# EAGLE design clvHd (EAGLE 9.6.2)
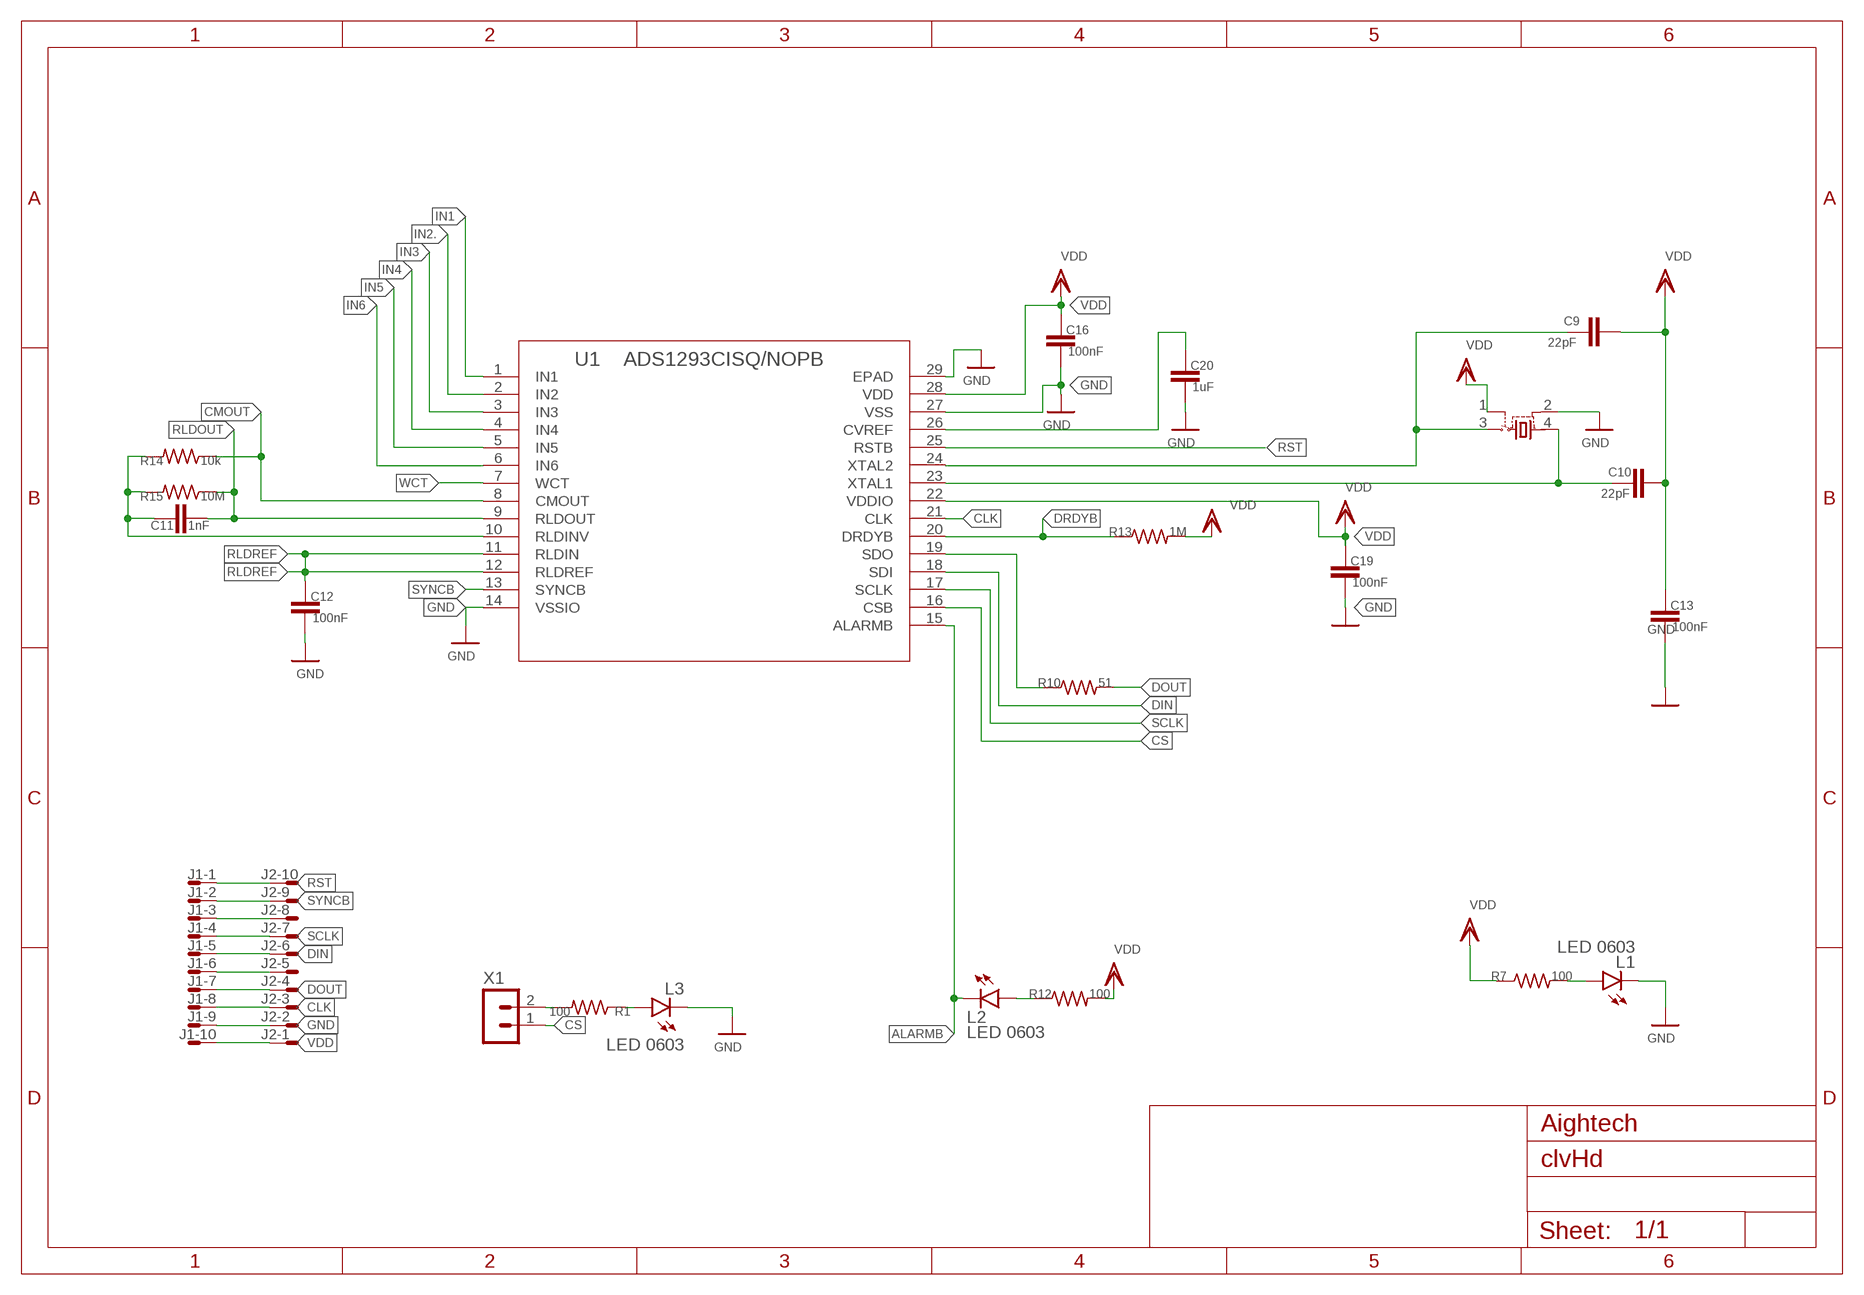
[diagram p0: schematic, sheet 1]

## Parts
C9  22pF  C-EUC0402  [C0402]
C10  22pF  C-EUC0402  [C0402]
C11  1nF  C-EUC0402  [C0402]
C12  100nF  C-EUC0402  [C0402]
C13  100nF  C-EUC0402  [C0402]
C16  100nF  C-EUC0402  [C0402]
C19  100nF  C-EUC0402  [C0402]
C20  1uF  C-EUC0402  [C0402]
J1  XF2J-1024-12  [XF2J-1024-12]
J2  XF2J-1024-12  [XF2J-1024-12]
L1  LED 0603  LEDCHIP-LED0603  [CHIP-LED0603]
L2  LED 0603  LEDCHIP-LED0603  [CHIP-LED0603]
L3  LED 0603  LEDCHIP-LED0603  [CHIP-LED0603]
R1  100  R-US_R0402  [R0402]
R7  100  R-US_R0402  [R0402]
R10  51  R-US_R0402  [R0402]
R12  100  R-US_R0402  [R0402]
R13  1M  R-US_R0402  [R0402]
R14  10k  R-US_R0402  [R0402]
R15  10M  R-US_R0402  [R0402]
U1  ADS1293CISQ/NOPB  [RSG28_3P6X3P6_TEX]
U$1  C387328  C387328  [SMD-3225_4P]
X1  BM02B-SRSS-TB  [BM02B-SRSS-TB]

## Nets
ALARMB: L2.C U1.15(ALARMB)
CLK: J1.8 J2.3 U1.21(CLK)
CMOUT: R14.1 U1.8(CMOUT)
CS: U1.16(CSB) X1.1
DIN: J1.5 J2.6 U1.18(SDI)
DOUT: J1.7 J2.4 R10.2
DRDYB: R13.1 U1.20(DRDYB)
GND: C12.2 C13.2 C16.2 C19.2 C20.2 J1.3 J1.6 J1.9 J2.2 J2.5 J2.8 L1.C L3.C U1.14(VSSIO) U1.27(VSS) U1.29(EPAD) U$1.2(GND)
IN1: U1.1(IN1)
IN2.: U1.2(IN2)
IN3: U1.3(IN3)
IN4: U1.4(IN4)
IN5: U1.5(IN5)
IN6: U1.6(IN6)
N$2: L1.A R7.2
N$3: R10.1 U1.19(SDO)
N$4: C10.2 U1.23(XTAL1) U$1.4(VDD)
N$5: R1.2 X1.2
N$6: L2.A R12.1
N$7: L3.A R1.1
N$8: C9.2 U1.24(XTAL2) U$1.3(OUT)
N$9: C20.1 U1.26(CVREF)
N$15: C11.1 R14.2 R15.2 U1.10(RLDINV)
RLDOUT: C11.2 R15.1 U1.9(RLDOUT)
RLDREF: C12.1 U1.11(RLDIN) U1.12(RLDREF)
RST: J1.1 J2.10 U1.25(RSTB)
SCLK: J1.4 J2.7 U1.17(SCLK)
SYNCB: J1.2 J2.9 U1.13(SYNCB)
VDD: C9.1 C10.1 C13.1 C16.1 C19.1 J1.10 J2.1 R7.1 R12.2 R13.2 U1.22(VDDIO) U1.28(VDD) U$1.1(TRI)
WCT: U1.7(WCT)

## Notes on the sheet
- Aightech

## Library data of the parts
C9-C13 C16 C19 C20 = rcl:C-EU: CAPACITOR, European symbol; SPICEPREFIX: C
J1 J2 = con-omron:XF2*-10?: OMRON FPC Connector Source : http://www.omron.com/ecb/products/pdf/fpc.pdf; OC_FARNELL: unknown; OC_NEWARK: unknown
L1-L3 = led:LED: LED OSRAM: - CHIPLED LG R971, LG N971, LY N971, LG Q971, LY Q971, LO R971, LY R971 LH N974, LH R974 LS Q976, LO Q976, LY Q976 LO Q996 - Hyper CHIPLED LW Q18S LB Q993, LB Q99A, LB R99A - SideLED LS A670, LO A670, LY A670, LG A670, LP A670 LB A673, LV A673, LT A673, LW A673 LH A674 LY A675 LS A676, LA A676, LO A676, LY A676, LW A676 LS A679, LY A679, LG A679 - Hyper Micro SIDELED® LS Y876, LA Y876, LO Y876, LY Y876 LT Y87S - SmartLED LW L88C, LW L88S LB L89C, LB L89S, LG L890 LS L89K, LO L89K, LY L89K LS L896, LA L896, LO L896, LY L896 - TOPLED LS T670, LO T670, LY T670, LG T670, LP T670 LSG T670, LSP T670, LSY T670, LOP T670, LYG T670 LG T671, LOG T671, LSG T671 LB T673, LV T673, LT T673, LW T673 LH T674 LS T676, LA T676, LO T676, LY T676, LB T676, LH T676, LSB T676, LW T676 LB T67C, LV T67C, LT T67C, LS T67K, LO T67K, LY T67K, LW E67C LS E67B, LA E67B, LO E67B, LY E67B, LB E67C, LV E67C, LT E67C LW T67C LS T679, LY T679, LG T679 LS T770, LO T770, LY T770, LG T770, LP T770 LB T773, LV T773, LT T773, LW T773 LH T774 LS E675, LA E675, LY E675, LS T675 LS T776, LA T776, LO T776, LY T776, LB T776 LHGB T686 LT T68C, LB T68C - Hyper Mini TOPLED® LB M676 - Mini TOPLED Santana® LG M470 LS M47K, LO M47K, LY M47K Source: http://www.osram.convergy.de LUXEON: - LUMILED® LXK2-PW12-R00, LXK2-PW12-S00, LXK2-PW14-U00, LXK2-PW14-V00 LXK2-PM12-R00, LXK2-PM12-S00, LXK2-PM14-U00 LXK2-PE12-Q00, LXK2-PE12-R00, LXK2-PE12-S00, LXK2-PE14-T00, LXK2-PE14-U00 LXK2-PB12-K00, LXK2-PB12-L00, LXK2-PB12-M00, LXK2-PB14-N00, LXK2-PB14-P00, LXK2-PB14-Q00 LXK2-PR12-L00, LXK2-PR12-M00, LXK2-PR14-Q00, LXK2-PR14-R00 LXK2-PD12-Q00, LXK2-PD12-R00, LXK2-PD12-S00 LXK2-PH12-R00, LXK2-PH12-S00 LXK2-PL12-P00, LXK2-PL12-Q00, LXK2-PL12-R00 Source: www.luxeon.com KINGBRIGHT: KA-3528ASYC Source: www.kingbright.com
R1 R7 R10 R12 R14 R15 = rcl:R-US_: RESISTOR, American symbol; SPICEPREFIX: R
R13 = rclCustom:R-US_: RESISTOR, American symbol; SPICEPREFIX: R
U1 = ADS:ADS1293CISQ/NOPB; BUILT_BY: EMA_UL_Team; MANUFACTURER_PART_NUMBER: ADS1293CISQ/NOPB; SOURCELIBRARY: TI_2016-05-20; VENDOR: Texas Instruments
U$1 = crystalCustom:C387328: 3.3Vdc CMOS SMD CRYSTAL CLOCK OSCILLATOR SOurce: www.abracon.com; OC_FARNELL: unknown; OC_NEWARK: unknown
X1 = con-JST SH:BM02B-SRSS: JST SH series header 1.00mm pitch disconnectable crimp style connectors, vertical (side entry type), 2 pins

## Board
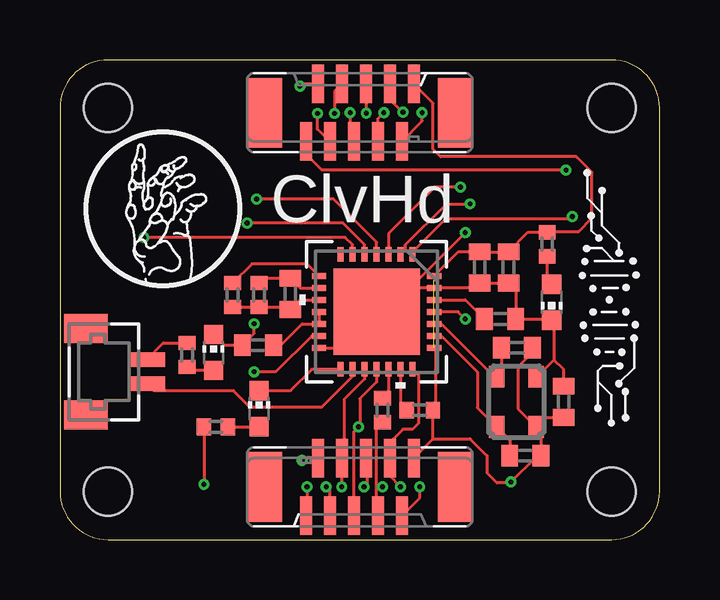
[diagram p1: board, top side]
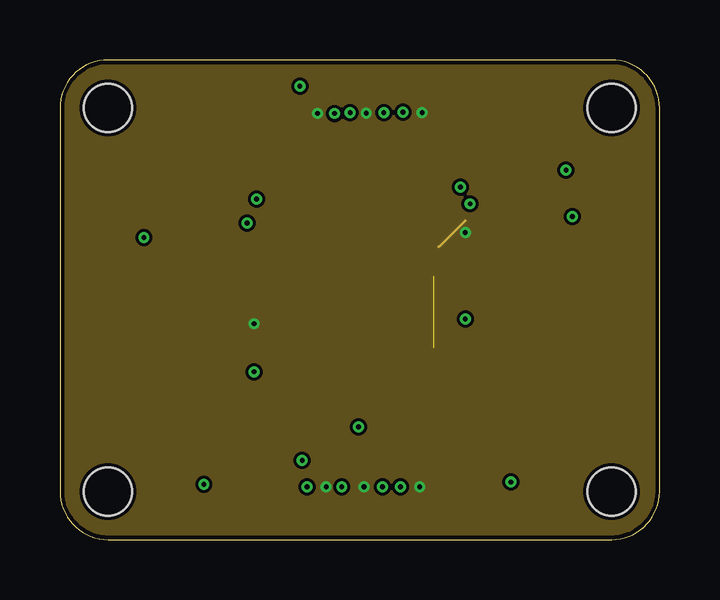
[diagram p2: board, inner layer Route2]
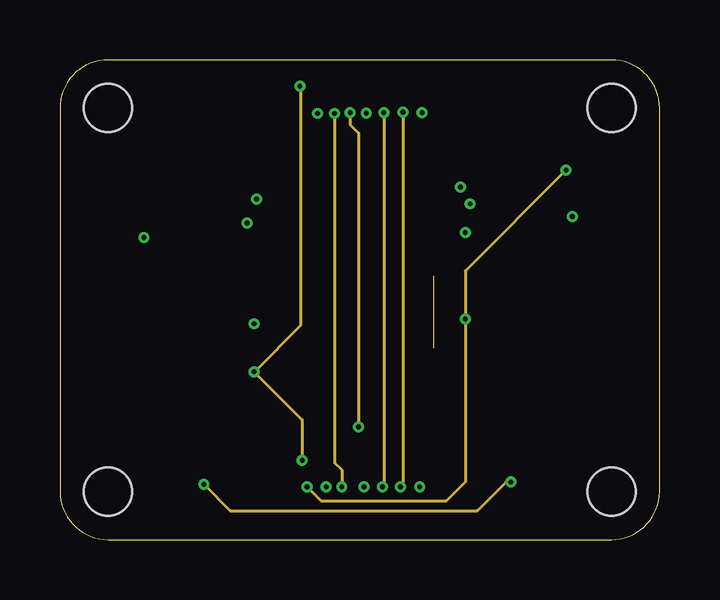
[diagram p3: board, inner layer Route15]
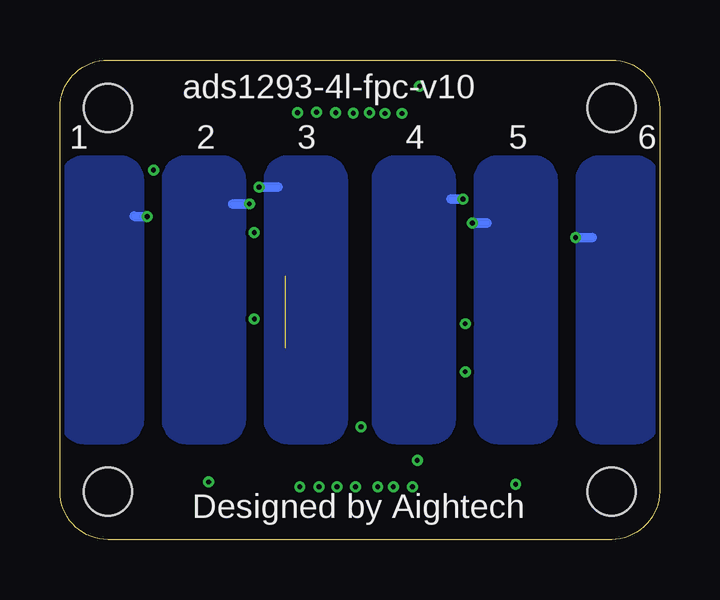
[diagram p4: board, bottom side, seen from below]

Size 25 x 20 mm. Coordinates in mm from the lower left corner, seen from the top.
Outline: 2,20 1.83,19.99 arc85 0,18 0,2 arc90 2,0 23,0 23.17,0.01 arc85 25,2 25,18 24.99,18.17 arc85 23,20 2,20
Copper layers (1*2*15*16): Top 0.035559375mm / dielectric 0.47751875mm / Route2 0.035559375mm / dielectric 0.47751875mm / Route15 0.035559375mm / dielectric 0.47751875mm / Bottom 0.035559375mm
Design rules "SparkFun-4-Layer-Minimum-JLCPCB": minimum track width 5mil, minimum drill 0.2mm, track to track 5mil, track to pad 5mil, pad to pad 5mil, via to via 5mil, smd to smd 5mil, copper to edge 7mil, drill to drill 7mil, minimum pad ring 5mil, minimum via ring 5mil, stop-mask expansion 2.5mil, vias tented up to drill 25mil, thermal gap 10mil
Holes 2 mm at 2,2 23,2 2,18 23,18

### Footprints (pad centres in the part's own frame; a part is rotated, then mirrored left to right if it is on the bottom)
C0402 = smd 0.7 x 0.9: 1 -0.65,0; 2 0.65,0
XF2J-1024-12 = smd 1.6 x 0.5: 1 -1.2,2.25; 2 1.2,1.75; 3 -1.2,1.25; 4 1.2,0.75; 5 -1.2,0.25; 6 1.2,-0.25; 7 -1.2,-0.75; 8 1.2,-1.25; 9 -1.2,-1.75; 10 1.2,-2.25 | smd 2.9 x 1.4: M1 0,3.95; M2 0,-3.95
CHIP-LED0603 = smd 0.8 x 0.8: A 0,-0.75; C 0,0.75
R0402 = smd 0.6 x 0.7: 1 -0.5,0; 2 0.5,0
R0402' = smd 0.6 x 0.7: 1 -0.55,0; 2 0.55,0
RSG28_3P6X3P6_TEX = smd 0.6 x 0.25: 1 -2.4,1.5; 2 -2.4,1; 3 -2.4,0.5; 4 -2.4,0; 5 -2.4,-0.5; 6 -2.4,-1; 7 -2.4,-1.5; 15 2.4,-1.5; 16 2.4,-1; 17 2.4,-0.5; 18 2.4,0; 19 2.4,0.5; 20 2.4,1; 21 2.4,1.5 | smd 0.25 x 0.6: 8 -1.5,-2.4; 9 -1,-2.4; 10 -0.5,-2.4; 11 0,-2.4; 12 0.5,-2.4; 13 1,-2.4; 14 1.5,-2.4; 22 1.5,2.4; 23 1,2.4; 24 0.5,2.4; 25 0,2.4; 26 -0.5,2.4; 27 -1,2.4; 28 -1.5,2.4 | smd 3.6 x 3.6: 29 0,0
SMD-3225_4P = smd 0.9 x 0.65: 1 -1.05,-0.825; 2 1.05,-0.825; 3 1.05,0.825; 4 -1.05,0.825
BM02B-SRSS-TB = smd 0.6 x 1.55: 1 0.5,0; 2 -0.5,0 | smd 1.2 x 1.8: M1 1.8,-2.525; M2 -1.8,-2.525

### Placement (x,y rotation side)
C9  19.05,8 180 top
C10  19.4,3.5 180 top
C11  9.6,10.25 90 top
C12  8.25,8.1 180 top
C13  21,5.75 90 top
C16  17.5,11.35 270 top
C19  18.7,11.35 270 top
C20  18.35,9.2 0 top
J1  12.5,2.2 90 top
J2  12.5,17.8 270 top
L1  20.5,9.9 180 top
L2  8.3,5.46 0 top
L3  6.4,7.8 0 top
R1  5.3,7.7 90 top
R7  20.31,12.32 270 top
R10  13.45,5.4 270 top
R12  6.5,4.7 180 top
R13  1M  [R0402']  15,5.4 0 top
R14  7.2,10.2 270 top
R15  8.3,10.2 270 top
U1  13.2,9.5 270 top
U$1  19.02,5.75 90 top
X1  3.61,7 270 top

### Tracks (layer width: path | path; a pad name or v marks a point on that pad's centre or on a via)
ALARMB
  Top 0.127: L2.C 9.62,6.21 10.51,7.1 U1.15
CLK  (via drill 0.2)
  Top 0.127: U1.21 14.95,6.85 14.95,4.85 14.7,4.6 14.3,4.6 13.75,4.05 J1.8 13.75,2.65 v14.2,2.2 | J2.3 13.75,18.35 14.3,17.8 v14.3,17.83
  Route15 0.127: v14.3,17.83 14.3,2.3 v14.2,2.2
CMOUT
  Top 0.127: U1.8 10.3,11.5 8,11.5 R14.1
CS
  Top 0.127: U1.16 12.2,6.81 10.91,5.52 7.92,5.52 7.24,6.2 3.91,6.2 X1.1
DIN  (via drill 0.2)
  Top 0.127: 12.45,4.74 v12.45,4.7 | v12.45,4.7 12.51,4.7 12.51,5.88 13.2,6.57 U1.18 | J1.5 12.25,4.5 v12.45,4.7 | v12.1,17.8 12.1,16.75 J2.6
  Route15 0.127: v12.1,17.8 12.1,17.3 12.45,16.95 v12.45,4.7
DOUT  (via drill 0.2)
  Top 0.127: J1.7 13.2,1.05 13.2,2.2 | 13.2,2.2 13.2,4.65 R10.2 | v13.45,2.2 13.2,2.2 | J2.4 13.25,17.54 v13.5,17.8
  Route15 0.127: v13.5,17.8 13.5,2.25 v13.45,2.2
DRDYB
  Top 0.127: U1.20 14.2,5.65 R13.1
GND  (via drill 0.2)
  Top 0.127: 20.6,7.5 20.6,9.05 L1.C 20.45,9.2 C20.2 19,10.4 C19.2 C16.2 17.3,10.5 U1.27 14.2,10.5 U1.29 | 20.6,7.5 19.9,6.8 U$1.2 | C13.2 21,7.1 20.6,7.5 | U1.14 11.7,8 U1.29 | v16.9,12.8 13.6,9.5 U1.29 | J1.3 11.25,2.05 v11.1,2.2 | J1.6 12.8,3.35 12.8,2.2 v12.68,2.2 | J1.9 15,1.75 v15,2.2 | L3.C 6.85,8.1 C12.2 8.1,8.6 v8.1,9 | J2.8 10.74,17.11 v10.74,17.77 | J2.5 12.75,17.8 v12.77,17.78 | J2.2 15.1,17.45 v15.1,17.8
  Route2 0.127: 16.9,13.3 15.8,12.2
  pour Route2: 0,20 25,20 25,0 0,0
IN1  (via drill 0.2)
  Top 0.127: U1.1 14.7,12 16.07,13.37 21.26,13.37 v21.36,13.47
  Bottom 0.4: 21.9,13.5 21.87,13.47 v21.36,13.47
  pour Bottom: 22.5,16 24,16 arc-90 25,15 25,5 arc-90 24,4 22.5,4 arc-90 21.5,5 21.5,15 arc-90
IN2.  (via drill 0.2)
  Top 0.127: U1.2 14.38,12.09 14.38,12.28 16.11,14 v17.1,14
  Bottom 0.4: v17.1,14 17.8,14
  pour Bottom: 18.25,16 19.75,16 arc-90 20.75,15 20.75,5 arc-90 19.75,4 18.25,4 arc-90 17.25,5 17.25,15 arc-90
IN3  (via drill 0.2)
  Top 0.127: U1.3 13.7,12.77 15.63,14.7 v16.7,14.7
  Bottom 0.4: v16.7,14.7 15.9,14.7
  pour Bottom: 14,16 15.5,16 arc-90 16.5,15 16.5,5 arc-90 15.5,4 14,4 arc-90 13,5 13,15 arc-90
IN4  (via drill 0.2)
  Top 0.127: U1.4 13.2,12.4 11.4,14.2 v8.2,14.2
  Bottom 0.4: v8.2,14.2 8.7,14.2
  pour Bottom: 9.5,16 11,16 arc-90 12,15 12,5 arc-90 11,4 9.5,4 arc-90 8.5,5 8.5,15 arc-90
IN5  (via drill 0.2)
  Top 0.127: U1.5 12.7,12.3 11.79,13.2 v7.8,13.2
  Bottom 0.4: v7.8,13.2 7.2,13.2
  pour Bottom: 5.25,16 6.75,16 arc-90 7.75,15 7.75,5 arc-90 6.75,4 5.25,4 arc-90 4.25,5 4.25,15 arc-90
IN6  (via drill 0.2)
  Top 0.127: U1.6 12.2,12.3 11.89,12.6 v3.5,12.6
  Bottom 0.4: v3.5,12.6 2.8,12.6
  pour Bottom: 1,16 2.5,16 arc-90 3.5,15 3.5,5 arc-90 2.5,4 1,4 arc-90 0,5 0,15 arc-90
N$2
  Top 0.127: R7.2 20.31,10.84 L1.A
N$3
  Top 0.127: U1.19 13.7,6.15 R10.1
N$4
  Top 0.127: C10.2 18.75,4.15 U$1.4 17.4,5.5 17.4,7 15.9,8.5 U1.23
N$5
  Top 0.127: X1.2 4.31,8.2 R1.2
N$6
  Top 0.127: R12.1 L2.A
N$7
  Top 0.127: R1.1 5.45,7.05 L3.A
N$8
  Top 0.127: U1.24 15.9,9 18.1,6.8 U$1.3 18.4,7 C9.2
N$9
  Top 0.127: U1.26 16.9,10 C20.1
N$15
  Top 0.127: R14.2 R15.2 9.5,9.7 C11.1 10,10 U1.10
RLDOUT
  Top 0.127: U1.9 10,10.5 C11.2 8.5,10.9 R15.1
RLDREF
  Top 0.127: U1.11 U1.12 10.1,9 9.2,8.1 C12.1
RST  (via drill 0.2)
  Top 0.127: v16.9,9.2 16.6,9.5 U1.25 | v10.3,2.2 10.3,1.05 J1.1 | v21.1,15.4 v21.09,15.41 10.92,15.41 10.25,16.08 J2.10
  Route15 0.127: v10.3,2.2 10.9,1.6 16.1,1.6 16.9,2.4 v16.9,9.2 16.9,11.2 v21.1,15.4
SCLK  (via drill 0.2)
  Top 0.127: U1.17 12.7,6.69 11.85,5.84 11.85,3.5 J1.4 v11.75,2.2 | J2.7 11.45,18.7 v11.45,17.77
  Route15 0.127: v11.45,17.77 11.45,3.2 11.75,2.9 v11.75,2.2
SYNCB  (via drill 0.2)
  Top 0.127: U1.13 10.5,8.5 9,7 v8.1,7 | 10.3,3.4 J1.2 10.2,3.4 v10.1,3.3 | J2.9 10.1,19 v10,18.9
  Route15 0.127: v10.1,3.3 10.1,5 v8.1,7 | v8.1,7 | v8.1,7 10.03,8.92 10.03,18.88 v10,18.9
VDD  (via drill 0.2)  (1 unrouted)
  Top 0.127: J1.10 15.55,4.2 | 15.55,4.2 R13.2 | U1.22 15.65,7.95 15.65,5.5 R13.2 | U$1.1 20.05,4.5 C10.1 19.9,3.5 v18.8,2.4 18.76,2.36 18.22,2.36 17.81,2.77 17.81,3.49 17.1,4.2 15.55,4.2 | R13.2 15.8,5.4 | C9.1 19.7,7.8 19.1,7.2 19.1,5.45 U$1.1 | U$1.1 20.25,5.1 C13.1 | U1.28 16.6,12 C16.1 C19.1 19.52,12.82 R7.1 | R7.1 20.41,12.82 | R12.2 v6,2.3 | J2.1 15.56,18.19 15.56,16.27 15.87,15.96 21.53,15.96 22.18,15.31 22.18,13.4 21.63,12.85 20.34,12.85 R7.1
  Route15 0.127: v6,2.3 7.1,1.2 17.4,1.2 18.7,2.5 v18.8,2.4

### Text on the board
tNames: ClvHd
bNames: ads1293-4l-fpc-v10 | 6 | 5 | 4 | 3 | 2 | 1 | Designed by Aightech